# Altium schematic sheet misc.SchDoc
size A3
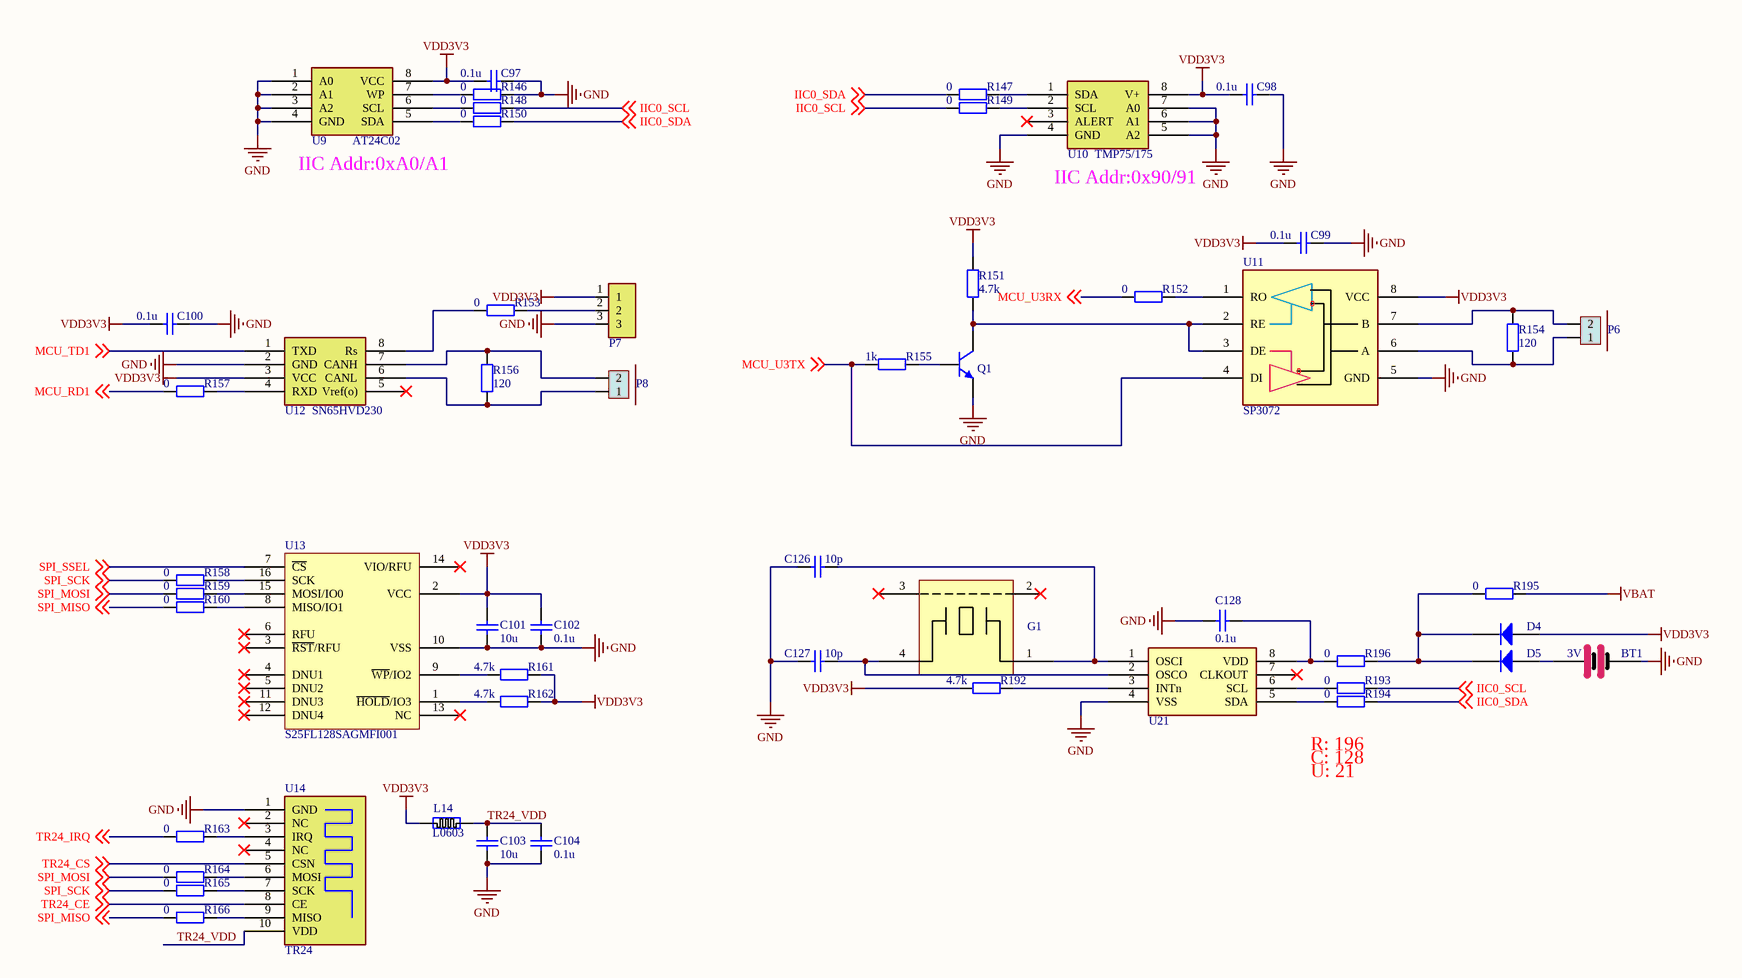
[diagram p0: misc.SchDoc]

## Parts
BT1  3V  [BT_SMT]
C97  0.1u  [C0603]
C98  0.1u  [C0603]
C99  0.1u  [C0603]
C100  0.1u  [C0603]
C101  10u  [C0603]
C102  0.1u  [C0603]
C103  10u  [C0603]
C104  0.1u  [C0603]
C126  10p  [C0603]
C127  10p  [C0603]
C128  0.1u  [C0603]
D4  D1N_SMT  [DIODE-SMT]  (value not drawn)
D5  D1N_SMT  [DIODE-SMT]  (value not drawn)
G1  Crystal-32768hz  [x4-0408]  (value not drawn)
L14  L0603  [L0603]
P6  PIN  [con-i150]  (value not drawn)
P7  SIP3  [HDR1X3]  (value not drawn)
P8  PIN  [con-i150]  (value not drawn)
Q1  NPN_SOT23  [T-SOT23]  (value not drawn)
R146  0  [R0603]
R147  0  [R0603]
R148  0  [R0603]
R149  0  [R0603]
R150  0  [R0603]
R151  4.7k  [R0603]
R152  0  [R0603]
R153  0  [R0603]
R154  120  [R0603]
R155  1k  [R0603]
R156  120  [R0603]
R157  0  [R0603]
R158  0  [R0603]
R159  0  [R0603]
R160  0  [R0603]
R161  4.7k  [R0603]
R162  4.7k  [R0603]
R163  0  [R0603]
R164  0  [R0603]
R165  0  [R0603]
R166  0  [R0603]
R192  4.7k  [R0603]
R193  0  [R0603]
R194  0  [R0603]
R195  0  [R0603]
R196  0  [R0603]
U9  AT24C02  [SO8/D/R-PDSO-G8]
U10  TMP75/175  [SO8/D/R-PDSO-G8]
U11  SP3072  [SO8/D/R-PDSO-G8]
U12  SN65HVD230  [SO8/D/R-PDSO-G8]
U13  S25FL128SAGMFI001  [SOP16-I50-370]
U14  TR24  [TR/JF24]
U21  PCF8563  [SOP8-I50-210]  (value not drawn)

## Nets
GND: BT1.1 C97.1 C98.1 C99.1 C100.1 C101.2 C102.2 C103.2 C104.2 C126.1 C127.1 C128.1 P7.3 Q1.2(E) R146.2 U9.1(A0) U9.2(A1) U9.3(A2) U9.4(GND) U10.4(GND) U10.5(A2) U10.6(A1) U10.7(A0) U11.5(GND) U12.2(GND) U13.10(VSS) U14.1(GND) U21.4(VSS)
VBAT: R195.1
VDD3V3: C97.2 C98.2 C99.2 C100.2 C101.1 C102.1 D4.1 L14.1 P7.1 R151.2 R161.2 R162.2 R192.1 U9.8(VCC) U10.8(V+) U11.8(VCC) U12.3(VCC) U13.2(VCC)
IIC0_SCL: R148.2 R149.1 R193.1 ; off-sheet IIC0_SCL
IIC0_SDA: R147.1 R150.2 R194.1 ; off-sheet IIC0_SDA
MCU_RD1: R157.1 ; off-sheet MCU_RD1
MCU_TD1: U12.1(TXD) ; off-sheet MCU_TD1
MCU_U3RX: R152.1 ; off-sheet MCU_U3RX
MCU_U3TX: R155.1 U11.4(DI) ; off-sheet MCU_U3TX
SPI_MISO: R160.1 R166.1 ; off-sheet SPI_MISO
SPI_MOSI: R159.1 R164.1 ; off-sheet SPI_MOSI
SPI_SCK: R158.1 R165.1 ; off-sheet SPI_SCK
SPI_SSEL: U13.7(~{CS}) ; off-sheet SPI_SSEL
TR24_CE: U14.8(CE) ; off-sheet TR24_CE
TR24_CS: U14.5(CSN) ; off-sheet TR24_CS
TR24_IRQ: R163.1 ; off-sheet TR24_IRQ
TR24_VDD: C103.1 C104.1 L14.2 U14.10(VDD)
NetBT1_2: BT1.2 D5.1
NetC126_2: C126.2 G1.1 U21.1(OSCI)
NetC127_2: C127.2 G1.4 U21.2(OSCO)
NetC128_2: C128.2 R196.2 U21.8(VDD)
NetD4_2: D4.2 D5.2 R195.2 R196.1
NetP6_1: P6.1 R154.1 U11.6(A)
NetP6_2: P6.2 R154.2 U11.7(B)
NetP7_2: P7.2 R153.2
NetP8_1: P8.1 R156.1 U12.6(CANL)
NetP8_2: P8.2 R156.2 U12.7(CANH)
NetQ1_1: Q1.1(B) R155.2
NetQ1_3: Q1.3(C) R151.1 U11.2(RE) U11.3(DE)
NetR146_1: R146.1 U9.7(WP)
NetR147_2: R147.2 U10.1(SDA)
NetR148_1: R148.1 U9.6(SCL)
NetR149_2: R149.2 U10.2(SCL)
NetR150_1: R150.1 U9.5(SDA)
NetR152_2: R152.2 U11.1(RO)
NetR153_1: R153.1 U12.8(Rs)
NetR157_2: R157.2 U12.4(RXD)
NetR158_2: R158.2 U13.16(SCK)
NetR159_2: R159.2 U13.15(MOSI/IO0)
NetR160_2: R160.2 U13.8(MISO/IO1)
NetR161_1: R161.1 U13.9(~{WP}/IO2)
NetR162_1: R162.1 U13.1(~{HOLD}/IO3)
NetR163_2: R163.2 U14.3(IRQ)
NetR164_2: R164.2 U14.6(MOSI)
NetR165_2: R165.2 U14.7(SCK)
NetR166_2: R166.2 U14.9(MISO)
NetR192_2: R192.2 U21.3(INTn)
NetR193_2: R193.2 U21.6(SCL)
NetR194_2: R194.2 U21.5(SDA)

Not connected (* = marked no-connect by the designer): G1 2* 3(20)*; U10 3(ALERT)*; U12 5(Vref(o))*; U13 3(~{RST}/RFU)* 4(DNU1)* 5(DNU2)* 6(RFU)* 11(DNU3)* 12(DNU4)* 13(NC)* 14(VIO/RFU)*; U14 2(NC)* 4(NC)*; U21 7(CLKOUT)*

## Notes on the sheet
- IIC Addr:0xA0/A1
- (near U10) IIC Addr:0x90/91
- R: 196
- C: 128
- U: 21

## Library data of the parts
BT1 = BT_SMT: 贴片电池座
C97-C104 C126-C128 = CAP0603: 0603 Capacitor without Polarity
D4 D5 = DIODE_SMT: 贴片二极管
G1 = Crystal-32768hz: Crystal 32.768k for RTC
L14 = L0603: 0603 Inductor
P6 P8 = SIP2: Connectors with two pins
P7 = SIP3: 单排3芯插针/座
Q1 = NPN_SOT23: NPN贴片封装,eg.S8050
R146-R166 R192-R196 = RES0603: 0603 Resistor
U9 = AT24C02: EEPROM
U10 = TMP75/175: 温度传感器
U11 = SP3072EEN-L/TR
U12 = SN65HVD230: CAN PHY
U13 = S25FL128SAGMFI001: SPI FLASH
U14 = TR24: 2.4G Wireless Reciver & Transmission Module
U21 = PCF8563: RTC